# EAGLE design custom_schematic (EAGLE 9.5.1)
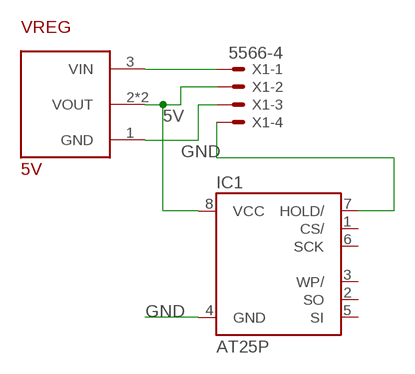
[diagram p0: schematic, sheet 1]

## Parts
IC1  AT25P  [DIL08]
VREG  5V  VOLTAGE-REGULATOR  [VOLTAGE-REGULATOR]
X1  5566-4  [5566-4]

## Nets
5V: IC1.8(VCC) VREG.2(VOUT) VREG.2B(VOUT) X1.2
GND: IC1.4(GND) VREG.1(GND) X1.3
N$1: VREG.3(VIN) X1.1
N$2: IC1.7(HOLD/) X1.4
Unconnected: IC1.1(CS/) IC1.2(SO) IC1.3(WP/) IC1.5(SI) IC1.6(SCK)

## Library data of the parts
IC1 = atmel:AT25*: SPI bus serial EEPROM; MPN: CAT25040LI-G; OC_FARNELL: 1718045; OC_NEWARK: 06R0588
VREG = my_lib:VOLTAGE-REGULATOR
X1 = con-molex:5566-4: Mini FIT connector 4 pol Source: http://www.molex.com; MF: MOLEX; OC_FARNELL: unknown; OC_NEWARK: unknown

## Board
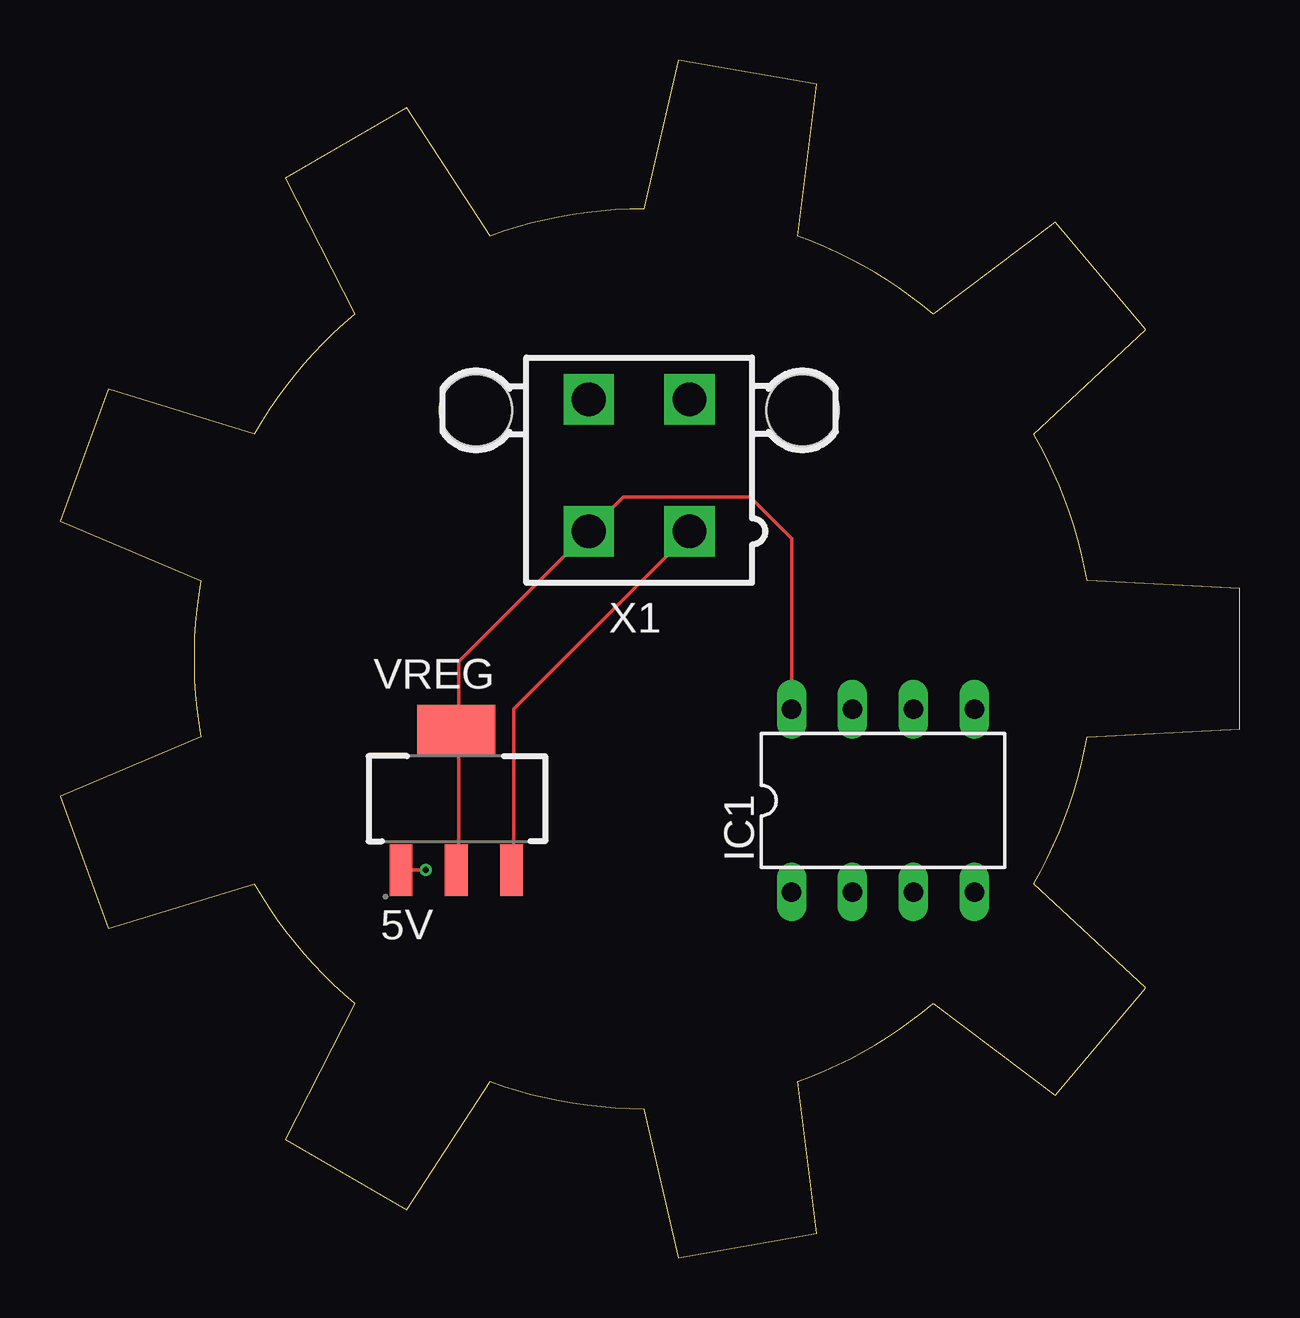
[diagram p1: board, top side]
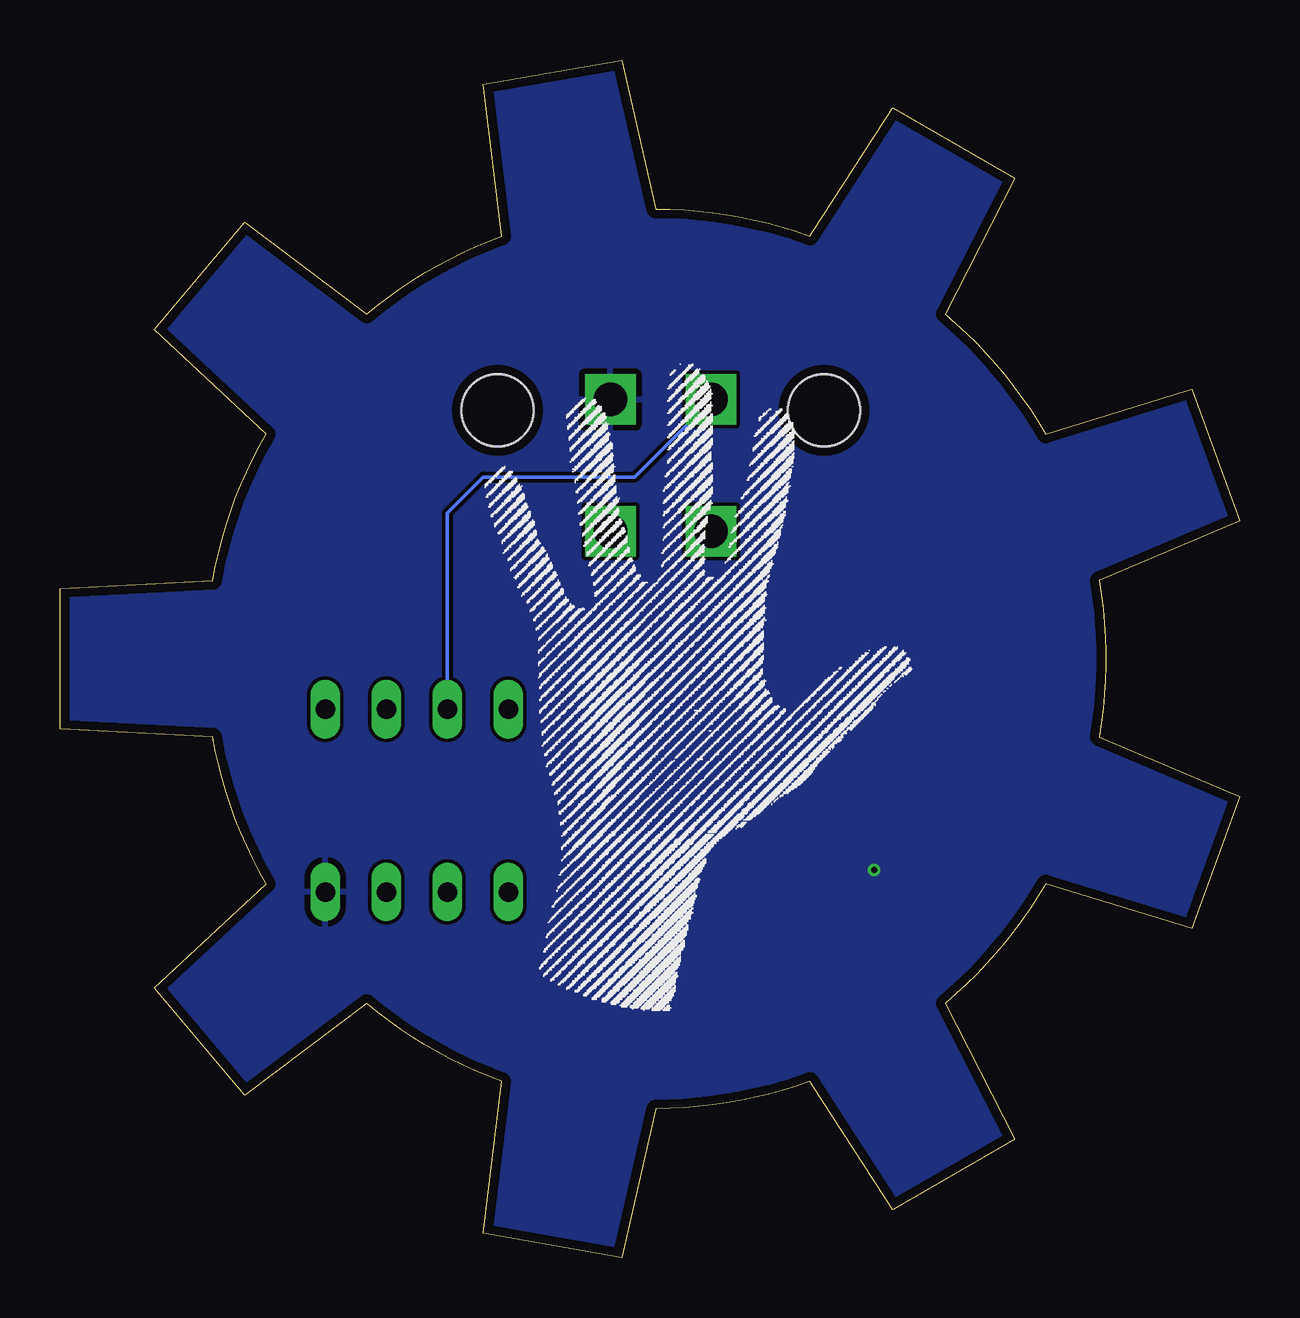
[diagram p2: board, bottom side, seen from below]

Size 49.16 x 49.92 mm. Coordinates in mm from the lower left corner, seen from the top.
Outline: 49.16,22.03 49.16,27.89 42.8,28.21 42.69,28.8 42.55,29.38 42.41,29.96 42.24,30.53 42.05,31.09 41.85,31.65 41.63,32.2 41.39,32.75 41.13,33.29 40.86,33.81 40.57,34.33 45.24,38.67 41.47,43.16 36.38,39.32 35.92,39.7 35.45,40.06 34.97,40.4 34.47,40.73 33.96,41.05 33.45,41.34 32.92,41.62 32.39,41.89 31.85,42.14 31.3,42.37 30.75,42.58 31.53,48.9 25.76,49.92 24.33,43.71 23.74,43.7 23.14,43.67 22.55,43.62 21.96,43.56 21.37,43.47 20.78,43.37 20.2,43.25 19.62,43.11 19.05,42.95 18.48,42.77 17.92,42.58 14.46,47.93 9.38,44.99 12.28,39.32 11.83,38.93 11.39,38.53 10.97,38.11 10.56,37.68 10.16,37.24 9.78,36.78 9.41,36.31 9.06,35.84 8.72,35.34 8.4,34.84 8.1,34.33 2,36.21 0,30.7 5.87,28.21 5.77,27.63 5.7,27.04 5.64,26.45 5.6,25.85 5.58,25.26 5.58,24.66 5.6,24.07 5.64,23.47 5.7,22.88 5.77,22.29 5.87,21.7 0,19.22 2,13.71 8.1,15.58 8.4,15.07 8.72,14.57 9.06,14.08 9.41,13.6 9.78,13.14 10.16,12.68 10.56,12.24 10.97,11.81 11.39,11.39 11.83,10.99 12.28,10.6 9.38,4.92 14.46,1.99 17.92,7.34 18.48,7.15 19.05,6.97 19.62,6.81 20.2,6.67 20.78,6.55 21.37,6.45 21.96,6.36 22.55,6.29 23.14,6.25 23.74,6.22 24.33,6.21 25.76,0 31.53,1.02 30.75,7.34 31.3,7.55 31.85,7.78 32.39,8.03 32.92,8.29 33.45,8.57 33.96,8.87 34.47,9.19 34.97,9.52 35.45,9.86 35.92,10.22 36.38,10.6 41.47,6.75 45.24,11.25 40.57,15.58 40.86,16.1 41.13,16.63 41.39,17.17 41.63,17.71 41.85,18.27 42.05,18.83 42.24,19.39 42.41,19.96 42.55,20.54 42.69,21.12 42.8,21.7 49.16,22.03
Copper layers (1*16): Top 0.035559375mm / dielectric 1.6mm / Bottom 0.035559375mm
Design rules "oshpark-2layer": minimum track width 6mil, minimum drill 10mil, track to track 6mil, track to pad 6mil, pad to pad 6mil, via to via 6mil, smd to smd 6mil, copper to edge 15mil, drill to drill 6mil, minimum pad ring 5mil, minimum via ring 5mil, stop-mask expansion 2.5mil, vias tented up to drill 0mil, thermal gap 10mil

### Footprints (pad centres in the part's own frame; a part is rotated, then mirrored left to right if it is on the bottom)
DIL08 = drill 0.813 long: 1 -3.81,-3.81; 2 -1.27,-3.81; 3 1.27,-3.81; 4 3.81,-3.81; 5 3.81,3.81; 6 1.27,3.81; 7 -1.27,3.81; 8 -3.81,3.81
VOLTAGE-REGULATOR = smd 0.95 x 2.15: 1 -2.3,-2.9; 2 0,-2.9; 3 2.3,-2.9 | smd 3.25 x 2.15: 2B 0,2.9
5566-4 = drill 1.4 square: 1 2.1,-2.75; 2 -2.1,-2.75; 3 2.1,2.75; 4 -2.1,2.75 | hole 3: 6.8,2.29; -6.8,2.29

### Placement (x,y rotation side)
IC1  34.29,19.05 0 top
VREG  16.51,19.05 0 top
X1  24.13,33.02 0 top

### Tracks (layer width: path | path; a pad name or v marks a point on that pad's centre or on a via)
5V
  Top 0.152: VREG.2 16.61,16.15 16.61,21.95 VREG.2B 16.61,22.1 16.61,24.84 21.95,30.18 X1.2 22.1,30.33 23.47,31.7 28.75,31.7 30.48,29.97 IC1.8
GND  (via drill 0.25)
  Top 0.152: v15.24,16.15 14.33,16.15 VREG.1
  pour Bottom: 3.56,-1.17 40.08,-1.88 57.15,26.92 36.88,55.32 0.94,54.26 -10.39,20.94
N$1
  Top 0.152: VREG.3 18.9,16.15 18.9,22.86 26.21,30.18 X1.1
N$2
  Bottom 0.152: X1.4 22.03,35.72 25.21,32.54 31.52,32.54 33.02,31.04 IC1.7